# EAGLE board M837bb (EAGLE 6.6.0), part 1 of 2
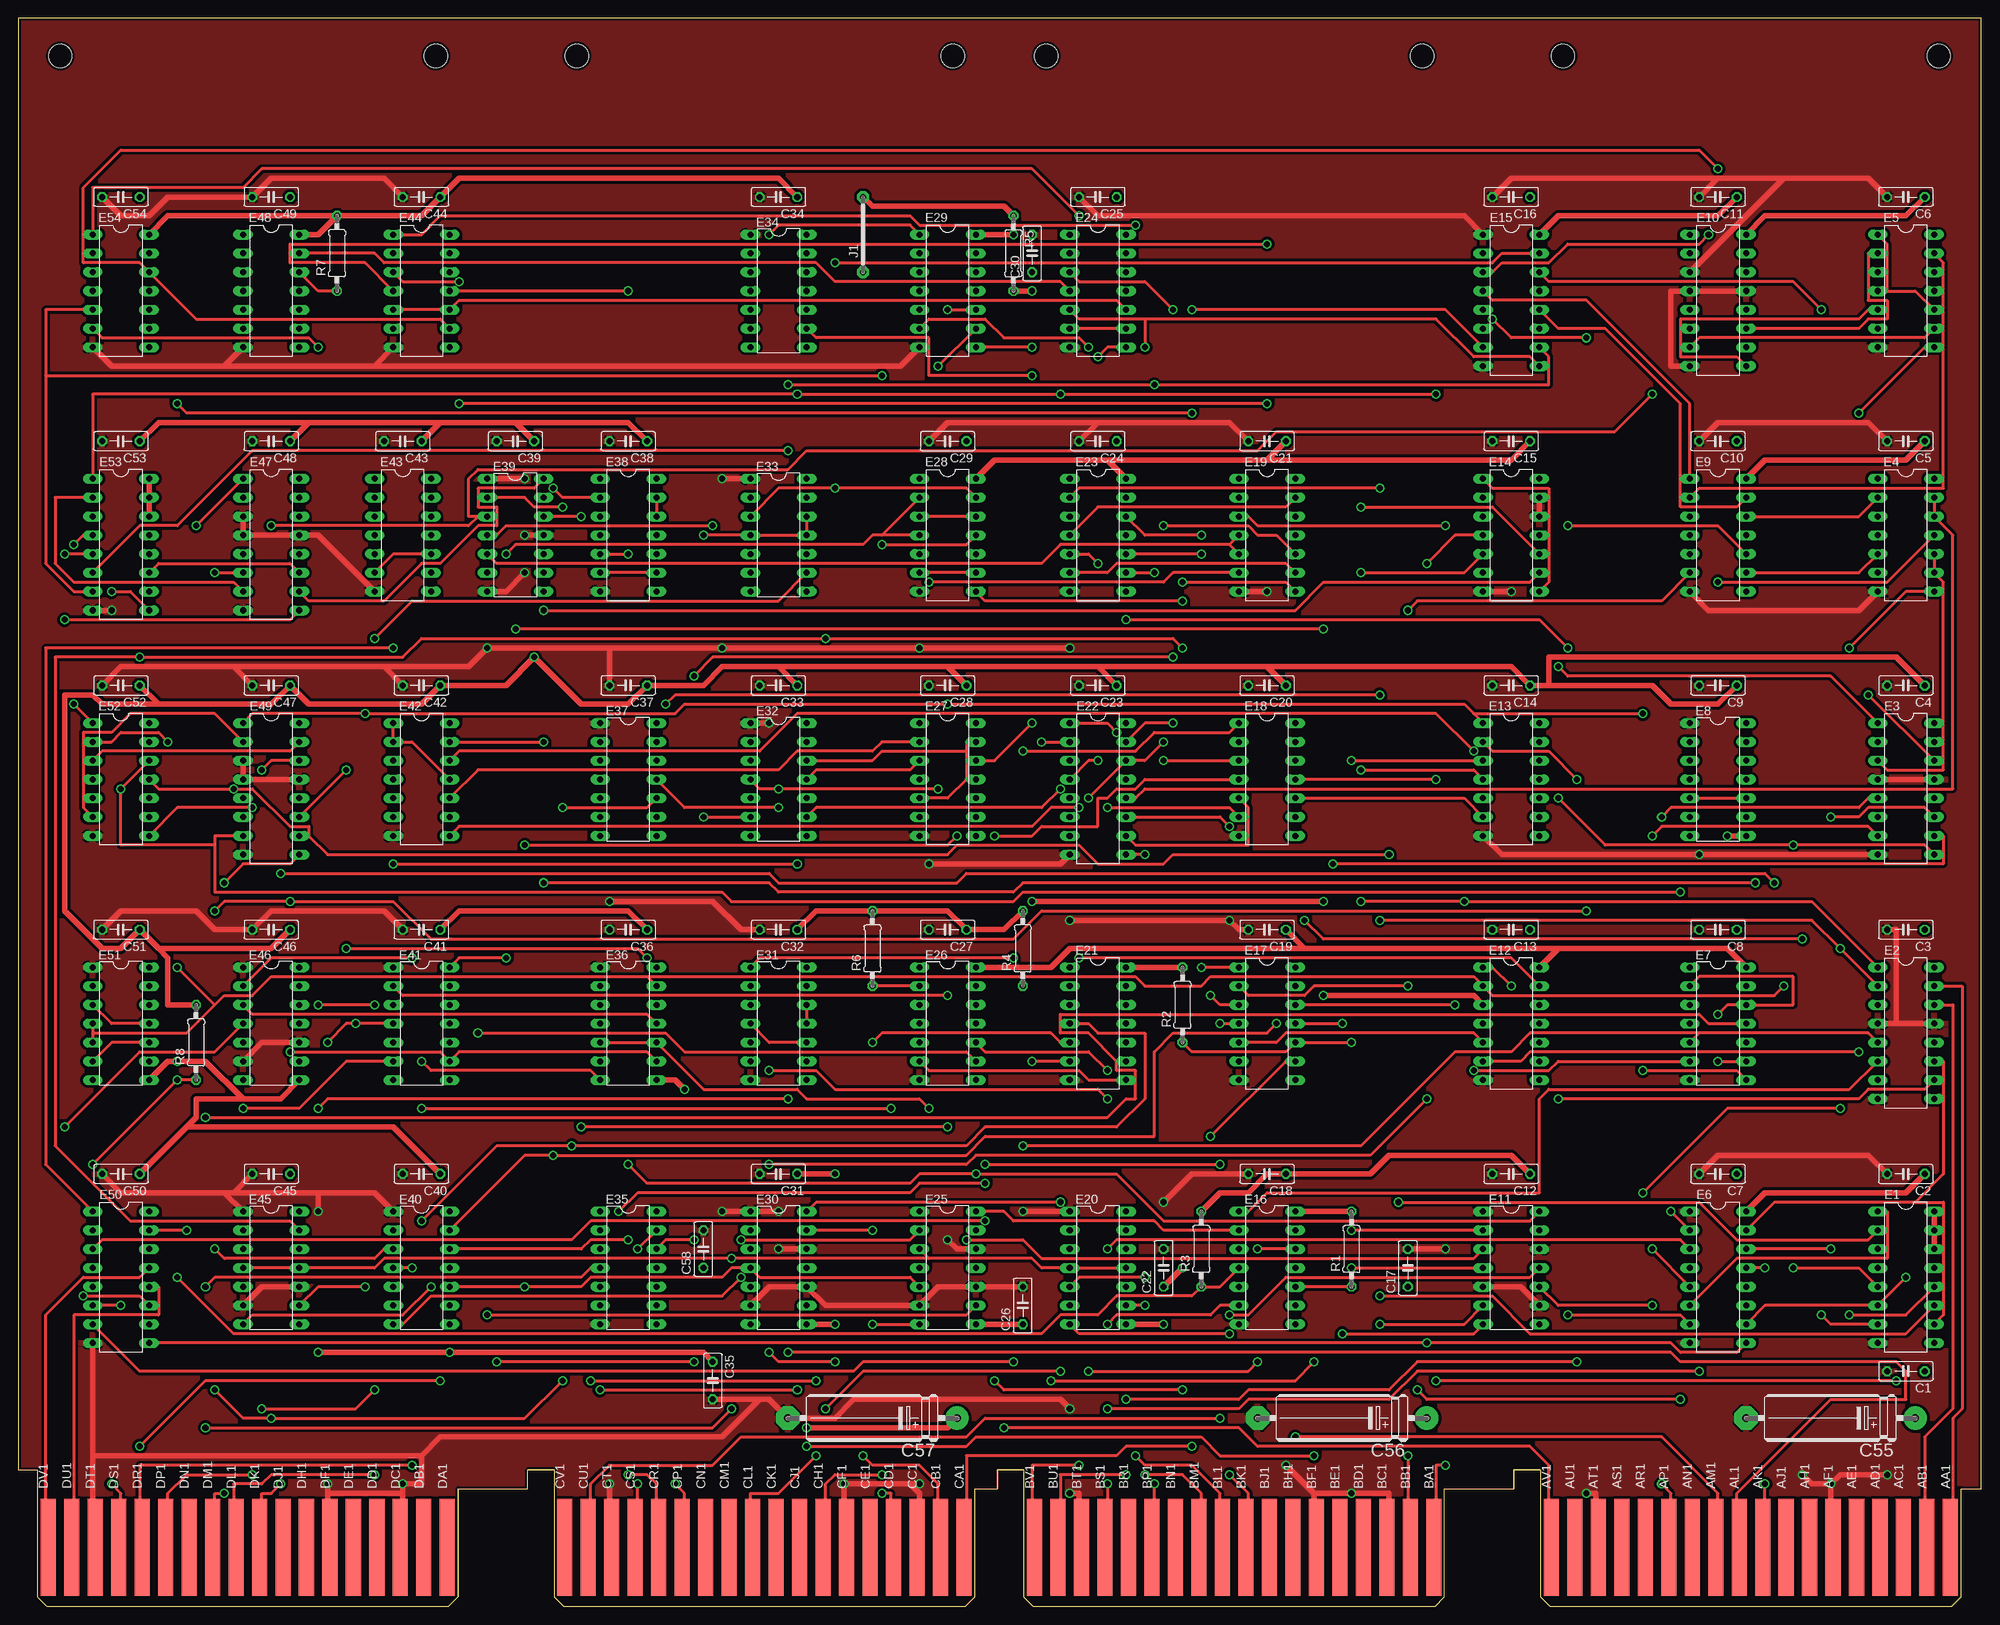
[diagram p7: board, top side]
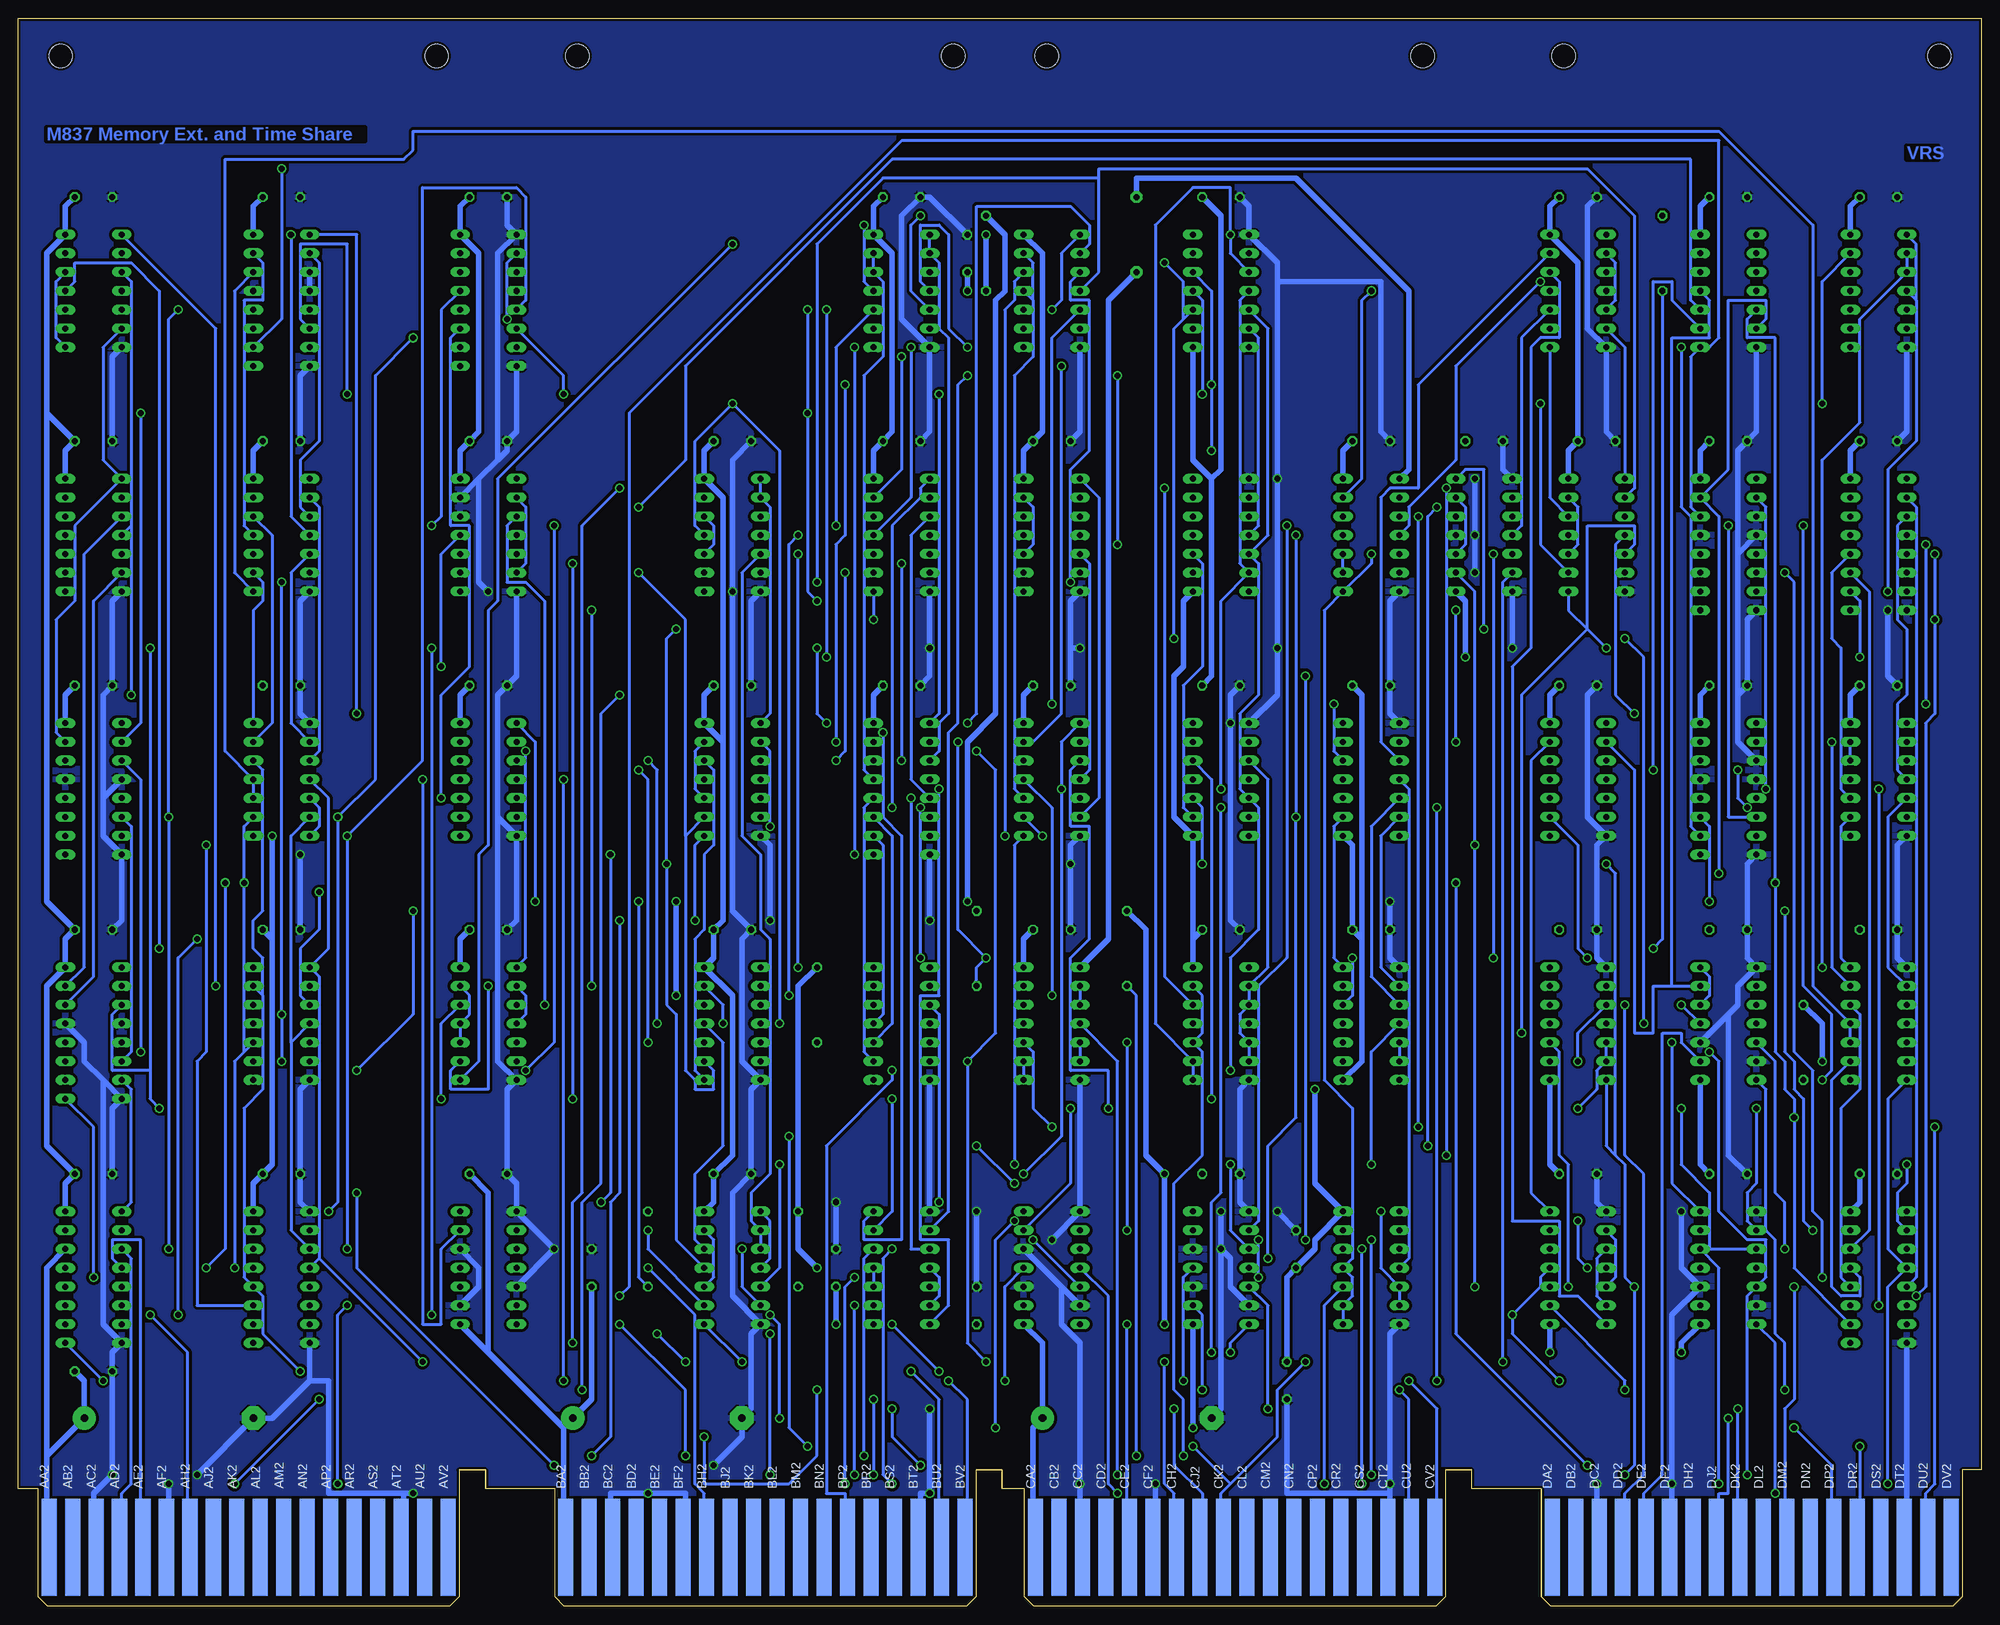
[diagram p8: board, bottom side, seen from below]

Size 265.3 x 214.63 mm. Coordinates in mm from the lower left corner, seen from the top.
Copper layers (1+16): Top 0.035mm / dielectric 1.5mm / Bottom 0.035mm
Design rules "16mils": minimum track width 16mil, minimum drill 32mil, track to track 15mil, track to pad 10mil, pad to pad 10mil, via to via 10mil, smd to smd 10mil, copper to edge 13mil, drill to drill 10mil, minimum pad ring 10mil, minimum via ring 8mil, stop-mask expansion 0mil, vias tented up to drill 0mil, thermal gap 10mil
Net classes: 1 Supply: width 0.762 mm

## Footprints (pad centres in the part's own frame; a part is rotated, then mirrored left to right if it is on the bottom)
C050-025X075 = drill 0.813 octagon: 1 -2.54,0; 2 2.54,0
E22-6 = drill 1.016 pad 3.15: + -11.43,0 | drill 1.016 pad 3.15 octagon: - 11.43,0
DIL16 = drill 0.813 long: 1 -8.89,-3.81; 2 -6.35,-3.81; 3 -3.81,-3.81; 4 -1.27,-3.81; 5 1.27,-3.81; 6 3.81,-3.81; 7 6.35,-3.81; 8 8.89,-3.81; 9 8.89,3.81; 10 6.35,3.81; 11 3.81,3.81; 12 1.27,3.81; 13 -1.27,3.81; 14 -3.81,3.81; 15 -6.35,3.81; 16 -8.89,3.81
DIL14 = drill 0.813 long: 1 -7.62,-3.81; 2 -5.08,-3.81; 3 -2.54,-3.81; 4 0,-3.81; 5 2.54,-3.81; 6 5.08,-3.81; 7 7.62,-3.81; 8 7.62,3.81; 9 5.08,3.81; 10 2.54,3.81; 11 0,3.81; 12 -2.54,3.81; 13 -5.08,3.81; 14 -7.62,3.81
EDGE-CON8 = smd 2.032 x 13.106: AA1 261.303,7.938; AB1 258.127,7.938; AC1 254.952,7.938; AD1 251.778,7.938; AE1 248.602,7.938; AF1 245.428,7.938; AH1 242.252,7.938; AJ1 239.077,7.938; AK1 235.903,7.938; AL1 232.727,7.938; AM1 229.553,7.938; AN1 226.377,7.938; AP1 223.202,7.938; AR1 220.028,7.938; AS1 216.852,7.938; AT1 213.678,7.938; AU1 210.502,7.938; AV1 207.327,7.938; BA1 191.452,7.938; BB1 188.278,7.938; BC1 185.102,7.938; BD1 181.928,7.938; BE1 178.752,7.938; BF1 175.577,7.938; BH1 172.403,7.938; BJ1 169.227,7.938; BK1 166.053,7.938; BL1 162.877,7.938; BM1 159.702,7.938; BN1 156.528,7.938; BP1 153.352,7.938; BR1 150.178,7.938; BS1 147.002,7.938; BT1 143.827,7.938; BU1 140.653,7.938; BV1 137.477,7.938; CA1 127.953,7.938; CB1 124.778,7.938; CC1 121.603,7.938; CD1 118.427,7.938; CE1 115.252,7.938; CF1 112.078,7.938; CH1 108.903,7.938; CJ1 105.728,7.938; CK1 102.552,7.938; CL1 99.377,7.938; CM1 96.203,7.938; CN1 93.028,7.938; CP1 89.853,7.938; CR1 86.677,7.938; CS1 83.502,7.938; CT1 80.328,7.938; CU1 77.153,7.938; CV1 73.978,7.938; DA1 58.102,7.938; DB1 54.928,7.938; DC1 51.752,7.938; DD1 48.578,7.938; DE1 45.403,7.938; DF1 42.227,7.938; DH1 39.053,7.938; DJ1 35.877,7.938; DK1 32.703,7.938; DL1 29.527,7.938; DM1 26.352,7.938; DN1 23.177,7.938; DP1 20.003,7.938; DR1 16.828,7.938; DS1 13.652,7.938; DT1 10.477,7.938; DU1 7.303,7.938; DV1 4.128,7.938 | smd 2.032 x 13.106 bottom: AA2 261.303,7.938; AB2 258.127,7.938; AC2 254.952,7.938; AD2 251.778,7.938; AE2 248.602,7.938; AF2 245.428,7.938; AH2 242.252,7.938; AJ2 239.077,7.938; AK2 235.903,7.938; AL2 232.727,7.938; AM2 229.553,7.938; AN2 226.377,7.938; AP2 223.202,7.938; AR2 220.028,7.938; AS2 216.852,7.938; AT2 213.678,7.938; AU2 210.502,7.938; AV2 207.327,7.938; BA2 191.452,7.938; BB2 188.278,7.938; BC2 185.102,7.938; BD2 181.928,7.938; BE2 178.752,7.938; BF2 175.577,7.938; BH2 172.403,7.938; BJ2 169.227,7.938; BK2 166.053,7.938; BL2 162.877,7.938; BM2 159.702,7.938; BN2 156.528,7.938; BP2 153.352,7.938; BR2 150.178,7.938; BS2 147.002,7.938; BT2 143.827,7.938; BU2 140.653,7.938; BV2 137.477,7.938; CA2 127.953,7.938; CB2 124.778,7.938; CC2 121.603,7.938; CD2 118.427,7.938; CE2 115.252,7.938; CF2 112.078,7.938; CH2 108.903,7.938; CJ2 105.728,7.938; CK2 102.552,7.938; CL2 99.377,7.938; CM2 96.203,7.938; CN2 93.028,7.938; CP2 89.853,7.938; CR2 86.677,7.938; CS2 83.502,7.938; CT2 80.328,7.938; CU2 77.153,7.938; CV2 73.978,7.938; DA2 58.102,7.938; DB2 54.928,7.938; DC2 51.752,7.938; DD2 48.578,7.938; DE2 45.403,7.938; DF2 42.227,7.938; DH2 39.053,7.938; DJ2 35.877,7.938; DK2 32.703,7.938; DL2 29.527,7.938; DM2 26.352,7.938; DN2 23.177,7.938; DP2 20.003,7.938; DR2 16.828,7.938; DS2 13.652,7.938; DT2 10.477,7.938; DU2 7.303,7.938; DV2 4.128,7.938
10 = drill 0.813 pad 1.6 octagon: 1 -5.08,0; 2 5.08,0
0207/10 = drill 0.813 octagon: 1 -5.08,0; 2 5.08,0
OMNIBUS = hole 3.175: 208.915,209.55; 259.715,209.55; 189.865,209.55; 139.065,209.55; 75.616,209.55; 126.416,209.55; 56.566,209.55; 5.766,209.55

## Placement (x,y rotation side)
C1  .01uf  [C050-025X075]  255.14,31.75 180 top
C2  .01uf  [C050-025X075]  255.14,58.42 180 top
C3  .01uf  [C050-025X075]  255.14,91.44 180 top
C4  .01uf  [C050-025X075]  255.14,124.46 180 top
C5  .01uf  [C050-025X075]  255.14,157.48 180 top
C6  .01uf  [C050-025X075]  255.14,190.5 180 top
C7  .01uf  [C050-025X075]  229.74,58.42 180 top
C8  .01uf  [C050-025X075]  229.74,91.44 180 top
C9  .01uf  [C050-025X075]  229.74,124.46 180 top
C10  .01uf  [C050-025X075]  229.74,157.48 180 top
C11  .01uf  [C050-025X075]  229.74,190.5 180 top
C12  .01uf  [C050-025X075]  201.8,58.42 180 top
C13  .01uf  [C050-025X075]  201.8,91.44 180 top
C14  .01uf  [C050-025X075]  201.8,124.46 180 top
C15  .01uf  [C050-025X075]  201.8,157.48 180 top
C16  .01uf  [C050-025X075]  201.8,190.5 180 top
C17  .01uf  [C050-025X075]  187.83,45.72 90 top
C18  .01uf  [C050-025X075]  168.78,58.42 180 top
C19  .01uf  [C050-025X075]  168.78,91.44 180 top
C20  .01uf  [C050-025X075]  168.78,124.46 180 top
C21  .01uf  [C050-025X075]  168.78,157.48 180 top
C22  .01uf  [C050-025X075]  154.81,45.72 90 top
C23  .01uf  [C050-025X075]  145.92,124.46 180 top
C24  .01uf  [C050-025X075]  145.92,157.48 180 top
C25  .01uf  [C050-025X075]  145.92,190.5 180 top
C26  .01uf  [C050-025X075]  135.76,40.64 90 top
C27  .01uf  [C050-025X075]  125.6,91.44 180 top
C28  .01uf  [C050-025X075]  125.6,124.46 180 top
C29  .01uf  [C050-025X075]  125.6,157.48 180 top
C30  .01uf  [C050-025X075]  137.03,182.88 90 top
C31  .01uf  [C050-025X075]  102.74,58.42 180 top
C32  .01uf  [C050-025X075]  102.74,91.44 180 top
C33  .01uf  [C050-025X075]  102.74,124.46 180 top
C34  .01uf  [C050-025X075]  102.74,190.5 180 top
C35  .01uf  [C050-025X075]  93.85,30.48 270 top
C36  .01uf  [C050-025X075]  82.42,91.44 180 top
C37  .01uf  [C050-025X075]  82.42,124.46 180 top
C38  .01uf  [C050-025X075]  82.42,157.48 180 top
C39  .01uf  [C050-025X075]  67.18,157.48 180 top
C40  .01uf  [C050-025X075]  54.48,58.42 180 top
C41  .01uf  [C050-025X075]  54.48,91.44 180 top
C42  .01uf  [C050-025X075]  54.48,124.46 180 top
C43  .01uf  [C050-025X075]  51.94,157.48 180 top
C44  .01uf  [C050-025X075]  54.48,190.5 180 top
C45  .01uf  [C050-025X075]  34.16,58.42 180 top
C46  .01uf  [C050-025X075]  34.16,91.44 180 top
C47  .01uf  [C050-025X075]  34.16,124.46 180 top
C48  .01uf  [C050-025X075]  34.16,157.48 180 top
C49  .01uf  [C050-025X075]  34.16,190.5 180 top
C50  .01uf  [C050-025X075]  13.84,58.42 180 top
C51  .01uf  [C050-025X075]  13.84,91.44 180 top
C52  .01uf  [C050-025X075]  13.84,124.46 180 top
C53  .01uf  [C050-025X075]  13.84,157.48 180 top
C54  .01uf  [C050-025X075]  13.84,190.5 180 top
C55  6.8uf  [E22-6]  244.98,25.4 180 top
C56  6.8uf  [E22-6]  178.94,25.4 180 top
C57  6.8uf  [E22-6]  115.44,25.4 180 top
C58  .01uf  [C050-025X075]  92.58,48.26 90 top
E1  DEC8235  [DIL16]  255.14,44.45 270 top
E2  DEC8271  [DIL16]  255.14,77.47 270 top
E3  DEC8271  [DIL16]  255.14,110.49 270 top
E4  7400N  [DIL14]  255.14,144.78 270 top
E5  7400N  [DIL14]  255.14,177.8 270 top
E6  DEC8235  [DIL16]  229.74,44.45 270 top
E7  N8881N  [DIL14]  229.74,78.74 270 top
E8  SP384N  [DIL14]  229.74,111.76 270 top
E9  7400N  [DIL14]  229.74,144.78 270 top
E10  DEC8271  [DIL16]  229.74,176.53 270 top
E11  SP380N  [DIL14]  201.8,45.72 270 top
E12  7410N  [DIL14]  201.8,78.74 270 top
E13  74S74N  [DIL14]  201.8,111.76 270 top
E14  7400N  [DIL14]  201.8,144.78 270 top
E15  8266  [DIL16]  201.8,176.53 270 top
E16  N8881N  [DIL14]  168.78,45.72 270 top
E17  74S74N  [DIL14]  168.78,78.74 270 top
E18  74H00N  [DIL14]  168.78,111.76 270 top
E19  7400N  [DIL14]  168.78,144.78 270 top
E20  SP380N  [DIL14]  145.92,45.72 270 top
E21  7410N  [DIL14]  145.92,78.74 270 top
E22  DEC8251  [DIL16]  145.92,110.49 270 top
E23  7404N  [DIL14]  145.92,144.78 270 top
E24  7400N  [DIL14]  145.92,177.8 270 top
E25  SP384N  [DIL14]  125.6,45.72 270 top
E26  N8881N  [DIL14]  125.6,78.74 270 top
E27  7404N  [DIL14]  125.6,111.76 270 top
E28  7400N  [DIL14]  125.6,144.78 270 top
E29  7410N  [DIL14]  125.6,177.8 270 top
E30  SP384N  [DIL14]  102.74,45.72 270 top
E31  N8881N  [DIL14]  102.74,78.74 270 top
E32  SP314N  [DIL14]  102.74,111.76 270 top
E33  SP314N  [DIL14]  102.74,144.78 270 top
E34  SP314N  [DIL14]  102.74,177.8 270 top
E35  N8881N  [DIL14]  82.42,45.72 270 top
E36  SP380N  [DIL14]  82.42,78.74 270 top
E37  SP314N  [DIL14]  82.42,111.76 270 top
E38  7420  [DIL14]  82.42,144.78 270 top
E39  SP380N  [DIL14]  67.18,144.78 270 top
E40  SP380N  [DIL14]  54.48,45.72 270 top
E41  SP384N  [DIL14]  54.48,78.74 270 top
E42  7410N  [DIL14]  54.48,111.76 270 top
E43  7420  [DIL14]  51.94,144.78 270 top
E44  7400N  [DIL14]  54.48,177.8 270 top
E45  SP380N  [DIL14]  34.16,45.72 270 top
E46  SP380N  [DIL14]  34.16,78.74 270 top
E47  DEC8271  [DIL16]  34.16,143.51 270 top
E48  7404N  [DIL14]  34.16,177.8 270 top
E49  DEC8271  [DIL16]  34.16,110.49 270 top
E50  DEC8235  [DIL16]  13.84,44.45 270 top
E51  SP384N  [DIL14]  13.84,78.74 270 top
E52  7400N  [DIL14]  13.84,111.76 270 top
E53  8266  [DIL16]  13.84,143.51 270 top
E54  7410N  [DIL14]  13.84,177.8 270 top
EDGE  [EDGE-CON8]  -0.13,0 0 top
J1  J10MM  [10]  114.17,185.42 90 top
R1  1K  [0207/10]  180.21,48.26 90 top
R2  1K  [0207/10]  157.35,81.28 90 top
R3  1K  [0207/10]  159.89,48.26 90 top
R4  1K  [0207/10]  135.76,88.9 90 top
R5  1K  [0207/10]  134.49,182.88 270 top
R6  1K  [0207/10]  115.44,88.9 90 top
R7  1K  [0207/10]  43.05,182.88 90 top
R8  1K  [0207/10]  24,76.2 90 top
U$1  OUTLINE-OMNIBUS  [OMNIBUS]  -0.13,0 0 top

## Tracks (layer width: path | path; a pad name or v marks a point on that pad's centre or on a via)
!!!(DF_ENAB*EMA_DISAB)  (via drill 0.81)
  Top 0.406: v191.64,111.76 E18.11 | v253.87,30.48 v191.64,30.48
  Bottom 0.406: v191.64,30.48 v191.64,111.76 | E1.9 v253.87,30.48
!!(DF_ENAB*EMA_DISAB)  (via drill 0.81)
  Top 0.406: v173.86,92.71 176.4,90.17 v241.17,90.17 | v243.71,39.37 244.98,38.1 E1.7
  Bottom 0.406: E18.8 173.86,102.87 v173.86,92.71 | v241.17,90.17 243.71,87.63 v243.71,39.37
!(GTF+RIB)  (via drill 0.81)
  Top 0.406: E50.9 v190.37,35.56 223.39,35.56 224.66,34.29 232.28,34.29 E6.9 | E23.2 143.38,151.13 v184.02,151.13
  Bottom 0.406: v184.02,151.13 189.1,146.05 189.1,55.88 190.37,54.61 v190.37,35.56
!(IND+RIF)  (via drill 0.81)
  Top 0.406: E6.7 224.66,39.37 v209.42,39.37 | v209.42,129.54 205.61,133.35 v149.73,133.35
  Bottom 0.406: v209.42,129.54 v209.42,39.37 | E23.8 v149.73,133.35
!(LA+TP3)  (via drill 0.81)
  Top 0.406: v34.16,146.05 60.83,146.05 62.1,147.32 | E39.3 62.1,147.32 | v220.85,163.83 215.77,158.75 170.05,158.75 167.51,156.21 106.55,156.21 104.01,153.67 62.1,153.67 60.83,152.4 60.83,147.32 62.1,147.32
  Bottom 0.406: E49.6 34.16,106.68 v34.16,146.05 | E10.6 227.2,173.99 227.2,184.15 220.85,184.15 v220.85,163.83
!(LA+TP4*LD_CTL)  (via drill 0.81)
  Top 0.406: v26.54,139.7 E47.6 | v21.46,44.45 29.08,36.83 138.3,36.83 140.84,39.37 145.92,39.37 148.46,41.91 158.62,41.91 R3.1 162.43,43.18 E16.4 | E2.6 247.52,69.85 206.88,69.85 205.61,68.58 205.61,55.88 168.78,55.88 166.24,53.34 E16.1
  Bottom 0.406: E2.6 250.06,74.93 250.06,105.41 E3.6 | v26.54,139.7 25.27,138.43 25.27,74.93 22.73,72.39 22.73,53.34 21.46,52.07 v21.46,44.45 | E16.1 163.7,52.07 163.7,46.99 E16.4
![D_IN+D(JMP+JMS)+(F*MD3)(JMP+JMS)]  (via drill 0.81)
  Top 0.406: v208.15,68.58 248.79,68.58 250.06,69.85 257.68,69.85 E2.10
  Bottom 0.406: E12.12 208.15,78.74 v208.15,68.58
!BUF_D_IN
  Top 0.406: E51.6 12.57,76.2 E51.10 | E51.3 12.57,78.74 E51.11 | E8.5 E8.10
  Bottom 0.406: E51.10 E51.11 22.73,83.82 22.73,186.69 35.43,199.39 211.96,199.39 211.96,196.85 213.23,195.58 237.36,195.58 237.36,115.57 E8.11 E8.10 | E8.7 224.66,105.41 224.66,107.95 E8.5
!CDF  (via drill 0.81)
  Top 0.406: E53.7 7.49,137.16 3.68,140.97 3.68,166.37 | 3.68,166.37 3.68,175.26 E54.5 | E28.11 128.14,143.51 v116.71,143.51 | 3.68,166.37 v116.71,166.37
  Bottom 0.406: v116.71,166.37 v116.71,143.51
!CIF  (via drill 0.81)
  Top 0.406: E28.8 130.68,135.89 v157.35,135.89 | v158.62,175.26 192.91,175.26 E15.7 | v21.46,162.56 22.73,161.29 v158.62,161.29
  Bottom 0.406: v157.35,135.89 158.62,137.16 v158.62,161.29 v158.62,175.26 | E54.13 21.46,179.07 v21.46,162.56
!CINT
  Bottom 0.406: E22.13 151,113.03 151,166.37 148.46,168.91 148.46,179.07 E24.12 E24.13
!CPMA_DISABLE  (via drill 0.81)
  Top 0.406: E11.11 204.34,44.45 171.32,44.45 166.24,39.37 v163.7,39.37 | v162.43,25.4 130.68,25.4 128.14,22.86 97.66,22.86 93.85,19.05 79.88,19.05 77.34,16.51 77.34,8.89 EDGE.CU1
  Bottom 0.406: v163.7,39.37 162.43,38.1 v162.43,25.4
!CUF  (via drill 0.81)
  Top 0.406: E22.4 144.65,114.3 v145.92,114.3 | v145.92,140.97 144.65,142.24 E23.5
  Bottom 0.406: v145.92,140.97 v145.92,114.3
!D  (via drill 0.81)
  Top 0.406: v48.13,29.21 45.59,26.67 v32.89,26.67
  Bottom 0.406: E40.9 48.13,30.48 v48.13,29.21 | v32.89,26.67 32.89,8.89 EDGE.DK2
!D_IN  (via drill 0.81)
  Top 0.406: E5.10 256.41,177.8 252.6,177.8 | E5.4 252.6,177.8 | E5.1 252.6,184.15 252.6,177.8 | E51.4 10.03,77.47 | 10.03,77.47 E51.5 | 84.96,85.09 E36.13 | 84.96,85.09 34.16,85.09 31.62,82.55 27.81,82.55 26.54,81.28 | 26.54,81.28 22.73,77.47 10.03,77.47 | 26.54,81.28 v21.46,86.36 | 84.96,85.09 151,85.09 152.27,83.82 159.89,83.82 161.16,85.09 196.72,85.09 E12.2 199.26,82.55 237.36,82.55 v238.63,83.82
  Bottom 0.406: E12.4 196.72,80.01 196.72,82.55 E12.2 | E54.2 E54.3 16.38,173.99 16.38,160.02 21.46,154.94 v21.46,86.36 | E5.1 238.63,172.72 v238.63,83.82
!DATA03  (via drill 0.81)
  Top 0.406: E50.3 11.3,49.53 74.8,49.53 77.34,52.07 v130.68,52.07 | v133.22,24.13 164.97,24.13 167.51,21.59 204.34,21.59 206.88,19.05 206.88,8.89 EDGE.AV1
  Bottom 0.406: v130.68,52.07 133.22,49.53 v133.22,24.13
!DATA05  (via drill 0.81)
  Top 0.406: v147.19,16.51 147.19,8.89 EDGE.BS1 | v147.19,48.26 148.46,49.53 224.66,49.53 E6.3
  Bottom 0.406: E6.3 228.47,50.8 228.47,76.2 | E7.4 228.47,76.2 | E8.6 228.47,104.14 228.47,76.2 | v147.19,16.51 148.46,17.78 148.46,46.99 v147.19,48.26
!DATA06  (via drill 0.81)
  Top 0.406: v149.73,17.78 140.84,17.78 140.84,8.89 EDGE.BU1 | v149.73,27.94 164.97,27.94 166.24,29.21 185.29,29.21 189.1,33.02 v210.69,33.02
  Bottom 0.406: 224.66,46.99 E6.4 | 224.66,46.99 224.66,85.09 E7.1 223.39,88.9 223.39,109.22 E8.4 | v149.73,27.94 v149.73,17.78 | 224.66,46.99 v210.69,33.02
!DATA07  (via drill 0.81)
  Top 0.406: v143.38,19.05 137.03,19.05 137.03,8.89 EDGE.BV1 | v147.19,26.67 164.97,26.67 166.24,27.94 185.29,27.94 189.1,31.75 v227.2,31.75
  Bottom 0.406: 232.28,82.55 232.28,69.85 234.82,67.31 234.82,44.45 E6.12 232.28,41.91 232.28,36.83 v227.2,31.75 | E7.13 232.28,82.55 | E8.12 232.28,113.03 232.28,93.98 233.55,92.71 233.55,88.9 232.28,87.63 232.28,82.55 | v143.38,19.05 147.19,22.86 v147.19,26.67
!DATA08  (via drill 0.81)
  Top 0.406: v236.09,45.72 E6.13 | v53.21,19.05 16.38,19.05 16.38,8.89 EDGE.DR1 | v70.99,97.79 101.47,97.79 102.74,96.52 134.49,96.52 135.76,97.79 v234.82,97.79
  Bottom 0.406: v236.09,45.72 236.09,73.66 234.82,74.93 | E7.10 234.82,74.93 | E8.9 234.82,105.41 v234.82,97.79 234.82,74.93 | v53.21,19.05 70.99,36.83 v70.99,97.79
!DATA09  (via drill 0.81)
  Top 0.406: v12.57,16.51 13.84,15.24 13.84,8.89 EDGE.DS1
  Bottom 0.406: E51.7 12.57,68.58 12.57,48.26 E50.4 12.57,43.18 v12.57,16.51
!DATA10
  Top 0.406: E50.12 18.92,43.18 18.92,39.37 7.49,39.37 7.49,8.89 EDGE.DU1
  Bottom 0.406: E50.12 18.92,44.45 18.92,67.31 16.38,69.85 16.38,80.01 E51.12
!DATA11
  Top 0.406: E50.13 16.38,44.45 8.76,44.45 3.68,39.37 3.68,8.89 EDGE.DV1
  Bottom 0.406: E51.9 20.19,71.12 20.19,43.18 18.92,41.91 16.38,41.91 16.38,44.45 E50.13
!DF_ENABLE
  Bottom 0.406: E17.8 173.86,72.39 173.86,90.17 172.59,91.44 172.59,101.6 171.32,102.87 171.32,113.03 E18.12
!EMA0
  Bottom 0.406: E1.3 250.06,46.99 250.06,16.51 251.33,15.24 251.33,8.89 EDGE.AD2
!EMA1
  Bottom 0.406: E1.4 252.6,46.99 252.6,49.53 248.79,49.53 248.79,8.89 EDGE.AE2
!EMA2  (via drill 0.81)
  Top 0.406: E1.12 255.14,39.37 v247.52,39.37
  Bottom 0.406: v247.52,39.37 242.44,34.29 242.44,8.89 EDGE.AH2
!EMA_DISABLE
  Top 0.406: E13.6 195.45,109.22 E18.10
  Bottom 0.406: E18.10 173.86,110.49 173.86,115.57 E18.13
!EXT_LD  (via drill 0.81)
  Top 0.406: v26.54,48.26 27.81,46.99 48.13,46.99 49.4,48.26 E40.3
  Bottom 0.406: E40.6 51.94,41.91 51.94,46.99 E40.3 | E46.5 27.81,73.66 27.81,55.88 26.54,54.61 v26.54,48.26
!F  (via drill 0.81)
  Top 0.406: v26.54,29.21 30.35,25.4 v34.16,25.4 68.45,25.4 v73.53,30.48 | E37.10 84.96,107.95 v73.53,107.95
  Bottom 0.406: E46.7 29.08,69.85 29.08,50.8 27.81,49.53 27.81,36.83 26.54,35.56 v26.54,29.21 | v34.16,25.4 34.16,15.24 35.43,15.24 35.43,8.89 EDGE.DJ2 | v73.53,30.48 v73.53,107.95
!F_SET  (via drill 0.81)
  Top 0.406: v96.39,26.67 93.85,24.13 v25.27,24.13
  Bottom 0.406: E30.5 96.39,40.64 v96.39,26.67 | v25.27,24.13 20.19,19.05 20.19,8.89 EDGE.DP2
!GTF  (via drill 0.81)
  Top 0.406: E18.4 152.27,111.76 151,110.49 148.46,110.49 147.19,109.22 145.92,109.22 145.92,105.41 138.3,105.41 137.03,104.14 v131.95,104.14
  Bottom 0.406: v131.95,104.14 131.95,175.26 130.68,176.53 130.68,179.07 E29.12
!IBIFDF_CLR  (via drill 0.81)
  Top 0.406: R1.1 E16.10 | E49.1 31.62,120.65 v46.86,120.65 88.77,120.65 90.04,121.92 v125.6,121.92 195.45,121.92 196.72,120.65 | 196.72,120.65 E13.1 | 196.72,120.65 v219.58,120.65 | E2.1 242.44,95.25 v195.45,95.25 v181.48,95.25
  Bottom 0.406: E16.13 171.32,49.53 171.32,44.45 E16.10 | v46.86,120.65 49.4,123.19 49.4,143.51 E43.4 | E29.5 125.6,171.45 v125.6,121.92 | E10.1 219.58,185.42 v219.58,120.65 | v195.45,95.25 195.45,116.84 E13.1 | R1.1 181.48,44.45 v181.48,95.25
!IND  (via drill 0.81)
  Top 0.406: E50.7 16.38,31.75 112.9,31.75 114.17,33.02 v134.49,33.02 | E21.6 v137.03,73.66 | E18.1 163.7,118.11 153.54,118.11 151,115.57 v135.76,115.57
  Bottom 0.406: E18.1 163.7,120.65 163.7,148.59 E19.2 E19.1 | v134.49,33.02 137.03,35.56 v137.03,73.66 133.22,77.47 133.22,113.03 v135.76,115.57
!IND1  (via drill 0.81)
  Top 0.406: v78.61,29.21 v105.28,29.21
  Bottom 0.406: E30.9 105.28,39.37 v105.28,29.21 | v78.61,29.21 77.34,27.94 77.34,8.89 EDGE.CU2
!IND2  (via drill 0.81)
  Top 0.406: v77.34,30.48 v107.82,30.48
  Bottom 0.406: E30.11 107.82,44.45 v107.82,30.48 | v77.34,30.48 73.53,26.67 73.53,8.89 EDGE.CV2
!INITIALIZE  (via drill 0.81)
  Top 0.406: E40.13 68.45,60.96 v72.26,60.96 128.14,60.96 130.68,63.5 153.54,63.5 153.54,74.93 156.08,77.47 168.78,77.47 v170.05,78.74 | v72.26,151.13 73.53,149.86 E38.2
  Bottom 0.406: v72.26,151.13 v72.26,60.96 | E17.13 170.05,81.28 v170.05,78.74
!INT_IN_PROGRESS  (via drill 0.81)
  Top 0.406: v76.07,147.32 E39.12 | v125.6,64.77 v76.07,64.77 | v147.19,72.39 144.65,74.93 130.68,74.93 E26.10
  Bottom 0.406: v76.07,64.77 v76.07,147.32 | v125.6,64.77 128.14,67.31 128.14,74.93 E26.10 | v147.19,72.39 147.19,71.12 156.08,62.23 156.08,15.24 153.54,15.24 153.54,8.89 EDGE.BP2
!INT_RQST  (via drill 0.81)
  Top 0.406: v88.77,16.51 90.04,15.24 90.04,8.89 EDGE.CP1
  Bottom 0.406: E35.10 88.77,40.64 v88.77,16.51
!INTERNAL_IO  (via drill 0.81)
  Top 0.406: E31.4 101.47,76.2 E31.10 | v107.82,20.32 102.74,15.24 98.93,15.24 98.93,8.89 EDGE.CL1
  Bottom 0.406: E31.13 105.28,82.55 105.28,77.47 E31.10 105.28,74.93 105.28,60.96 109.09,57.15 109.09,29.21 107.82,27.94 v107.82,20.32
!IO_PAUSE  (via drill 0.81)
  Top 0.406: v116.71,15.24 117.98,15.24 117.98,8.89 EDGE.CD1
  Bottom 0.406: E25.4 117.98,41.91 117.98,16.51 v116.71,15.24
!IR00  (via drill 0.81)
  Top 0.406: v48.13,81.28 v40.51,81.28
  Bottom 0.406: v40.51,81.28 E46.11 | v48.13,81.28 48.13,60.96 45.59,58.42 45.59,17.78 48.13,15.24 48.13,8.89 EDGE.DD2
!IR01
  Bottom 0.406: E46.9 40.51,76.2 40.51,77.47 43.05,77.47 43.05,17.78 45.59,15.24 45.59,8.89 EDGE.DE2
!KEY_CTL  (via drill 0.81)
  Top 0.406: E46.4 26.54,74.93 16.38,74.93 v6.22,64.77
  Bottom 0.406: v6.22,64.77 6.22,16.51 7.49,15.24 7.49,8.89 EDGE.DU2
!LOAD_CNTL  (via drill 0.81)
  Top 0.406: E40.10 v68.45,43.18 76.07,43.18 77.34,44.45 95.12,44.45 96.39,45.72 E30.4 100.2,44.45 120.52,44.45 E25.5 | E11.3 196.72,46.99 138.3,46.99 135.76,49.53 v128.14,49.53 | v126.87,104.14 125.6,102.87 v68.45,102.87
  Bottom 0.406: E25.5 v128.14,49.53 | E39.9 68.45,137.16 v68.45,102.87 v68.45,43.18 | v126.87,104.14 E27.9
!MD00  (via drill 0.81)
  Top 0.406: v87.5,121.92 88.77,123.19 v184.02,123.19 | v189.1,29.21 190.37,27.94 v224.66,27.94 | v236.09,16.51 236.09,8.89 EDGE.AK1
  Bottom 0.406: E37.12 87.5,115.57 v87.5,121.92 | v184.02,123.19 186.56,120.65 186.56,57.15 189.1,54.61 v189.1,29.21 | v236.09,16.51 v224.66,27.94
!MD01  (via drill 0.81)
  Top 0.406: E37.11 90.04,107.95 v102.74,107.95 | v104.01,34.29 223.39,34.29 224.66,33.02 253.87,33.02 255.14,31.75 255.14,27.94 244.98,27.94 232.28,15.24 232.28,8.89 EDGE.AL1
  Bottom 0.406: v102.74,107.95 102.74,55.88 104.01,54.61 v104.01,34.29
!MD02  (via drill 0.81)
  Top 0.406: v131.95,30.48 133.22,29.21 v157.35,29.21 | v172.59,22.86 222.12,22.86 229.74,15.24 229.74,8.89 EDGE.AM1
  Bottom 0.406: E25.11 131.95,43.18 v131.95,30.48 | v157.35,29.21 157.35,20.32 161.16,16.51 172.59,16.51 v172.59,22.86
!MD03  (via drill 0.81)
  Top 0.406: E11.10 208.15,40.64 v220.85,40.64 | v222.12,16.51 223.39,15.24 223.39,8.89 EDGE.AP1
  Bottom 0.406: v220.85,40.64 222.12,39.37 v222.12,16.51
!MD04  (via drill 0.81)
  Top 0.406: E20.7 143.38,36.83 v163.7,36.83 | v163.7,17.78 166.24,15.24 166.24,8.89 EDGE.BK1 | E32.9 107.82,107.95 138.3,107.95 v140.84,110.49
  Bottom 0.406: E32.9 107.82,107.95 107.82,124.46 105.28,127 105.28,140.97 E33.10 | v163.7,17.78 v163.7,36.83 | v140.84,110.49 140.84,82.55 143.38,82.55 143.38,49.53 139.57,49.53 139.57,40.64 E20.7
!MD05  (via drill 0.81)
  Top 0.406: v151,20.32 152.27,19.05 158.62,19.05 162.43,15.24 162.43,8.89 EDGE.BL1
  Bottom 0.406: E20.12 151,46.99 v151,20.32
!MD06  (via drill 0.81)
  Top 0.406: v152.27,40.64 E20.9 | v152.27,17.78 157.35,17.78 159.89,15.24 159.89,8.89 EDGE.BM1
  Bottom 0.406: v152.27,17.78 v152.27,40.64
!MD07  (via drill 0.81)
  Top 0.406: E20.5 143.38,44.45 v152.27,44.45 | v153.54,16.51 153.54,8.89 EDGE.BP1
  Bottom 0.406: v152.27,44.45 153.54,43.18 v153.54,16.51
!MD08  (via drill 0.81)
  Top 0.406: v35.43,16.51 34.16,15.24 32.89,15.24 32.89,8.89 EDGE.DK1
  Bottom 0.406: E45.12 35.43,45.72 v35.43,16.51
!MD09  (via drill 0.81)
  Top 0.406: E45.9 40.51,43.18 v46.86,43.18 | v50.67,100.33 v105.28,100.33 | v48.13,17.78 34.16,17.78 32.89,16.51 29.08,16.51 29.08,8.89 EDGE.DL1
  Bottom 0.406: 49.4,60.96 50.67,62.23 E41.7 | 49.4,60.96 48.13,59.69 48.13,44.45 v46.86,43.18 46.86,19.05 v48.13,17.78 | E32.10 105.28,107.95 v105.28,100.33 | v50.67,100.33 49.4,99.06 49.4,60.96
!MD10  (via drill 0.81)
  Top 0.406: v27.81,15.24 26.54,15.24 26.54,8.89 EDGE.DM1 | v55.75,43.18 51.94,39.37 31.62,39.37 E45.7
  Bottom 0.406: E45.7 27.81,35.56 v27.81,15.24 | E41.10 57.02,74.93 57.02,60.96 55.75,59.69 v55.75,43.18
!MD11  (via drill 0.81)
  Top 0.406: E36.9 84.96,74.93 59.56,74.93 E41.9 57.02,74.93 v36.7,74.93 | v31.62,17.78 22.73,17.78 20.19,15.24 20.19,8.89 EDGE.DP1
  Bottom 0.406: v31.62,17.78 31.62,41.91 E45.5 29.08,44.45 29.08,49.53 31.62,49.53 35.43,53.34 35.43,73.66 v36.7,74.93
!POWER_OK  (via drill 0.81)
  Top 0.406: E11.2 v180.21,50.8
  Bottom 0.406: E16.9 180.21,48.26 v180.21,50.8
!RDF
  Top 0.406: E4.13 E4.12 261.49,144.78 261.49,110.49 152.27,110.49 151,109.22 E22.12
  Bottom 0.406: E21.9 151,74.93 151,107.95 E22.12
!RIB
  Top 0.406: E18.5 166.24,107.95 166.24,102.87 151,102.87 E22.10
  Bottom 0.406: E21.11 148.46,80.01 148.46,102.87 E22.10
!RIF  (via drill 0.81)
  Top 0.406: v163.7,105.41 162.43,106.68 E22.11
  Bottom 0.406: E21.10 147.19,78.74 147.19,104.14 E22.11 | E18.2 163.7,115.57 v163.7,105.41
!RMF  (via drill 0.81)
  Top 0.406: E53.9 15.11,137.16 v12.57,137.16 | E24.5 143.38,173.99 152.27,173.99 | 152.27,173.99 191.64,173.99 196.72,168.91 204.34,168.91 E15.9 | v152.27,101.6 E22.9 | 152.27,173.99 v152.27,170.18 | E54.1 10.03,191.77 30.35,191.77 32.89,194.31 137.03,194.31 v143.38,187.96
  Bottom 0.406: v12.57,137.16 12.57,153.67 8.76,157.48 8.76,176.53 | E54.4 8.76,176.53 | E54.1 8.76,184.15 8.76,176.53 | v152.27,170.18 v152.27,101.6 | v143.38,187.96 144.65,186.69 144.65,177.8 E24.5
!RTF  (via drill 0.81)
  Top 0.406: v137.03,170.18 E29.8 | E48.13 48.13,182.88 49.4,181.61 107.82,181.61 110.36,179.07 140.84,179.07 E24.4
  Bottom 0.406: v137.03,170.18 139.57,172.72 139.57,185.42 140.84,186.69 143.38,186.69 143.38,179.07 E24.4
!RUN  (via drill 0.81)
  Top 0.406: v167.51,33.02 166.24,31.75 v144.65,31.75
  Bottom 0.406: v167.51,33.02 E16.8 | v144.65,31.75 140.84,27.94 140.84,8.89 EDGE.BU2
!SINT
  Bottom 0.406: E22.3 140.84,115.57 140.84,119.38 139.57,120.65 139.57,171.45 140.84,172.72 140.84,181.61 E24.2 E24.1
!SKIP  (via drill 0.81)
  Top 0.406: v83.69,48.26 E35.13 | v83.69,16.51 83.69,8.89 EDGE.CS1
  Bottom 0.406: v83.69,16.51 v83.69,48.26
!SUF
  Bottom 0.406: E22.5 144.65,111.76 144.65,144.78 E23.3
!TP_CB1
  Bottom 0.762: E26.1 117.98,90.17 117.98,176.53 J1.1
!TS1  (via drill 0.81)
  Top 0.406: v91.31,33.02 v64.64,33.02 | E11.6 195.45,38.1 v184.02,38.1 | v175.13,20.32 162.43,20.32 159.89,22.86 129.41,22.86 128.14,21.59 v106.55,21.59
  Bottom 0.406: E39.6 64.64,138.43 v64.64,33.02 | v91.31,33.02 95.12,29.21 95.12,22.86 101.47,16.51 | 101.47,16.51 102.74,15.24 102.74,8.89 EDGE.CK2 | v184.02,38.1 175.13,29.21 v175.13,20.32 | 101.47,16.51 v106.55,21.59
!TS_DISABLE  (via drill 0.81)
  Top 0.762: E12.3 196.72,82.55 v176.4,82.55 | v137.03,95.25 v176.4,95.25 | J1.2 115.44,189.23 133.22,189.23 R5.1
  Bottom 0.762: E38.1 77.34,153.67 77.34,177.8 92.58,193.04 114.17,193.04 J1.2 | v176.4,95.25 v176.4,82.55 | v137.03,95.25 137.03,116.84 133.22,120.65 133.22,176.53 131.95,177.8 131.95,185.42 R5.1
!USER_MODE  (via drill 0.81)
  Top 0.406: v25.27,43.18 26.54,44.45 76.07,44.45 77.34,45.72 E35.4
  Bottom 0.406: E35.4 77.34,46.99 77.34,110.49 E37.4 | v25.27,43.18 25.27,27.94 26.54,26.67 26.54,8.89 EDGE.DM2
(D_IN+CIF+RMF)  (via drill 0.81)
  Top 0.406: v229.74,194.31 227.2,196.85 13.84,196.85 8.76,191.77 8.76,181.61 16.38,181.61 E54.12 24,173.99 57.02,173.99 E44.9
  Bottom 0.406: E10.10 229.74,173.99 v229.74,194.31
C1L  (via drill 0.81)
  Top 0.406: v116.71,17.78 110.36,17.78 109.09,16.51 109.09,8.89 EDGE.CH1
  Bottom 0.406: E26.4 116.71,73.66 v116.71,17.78
CINT  (via drill 0.81)
  Top 0.406: v151,186.69 121.79,186.69 120.52,187.96 57.02,187.96 54.48,185.42 E44.1
  Bottom 0.406: E24.11 151,179.07 v151,186.69
CPMA_DISABLE  (via drill 0.81)
  Top 0.406: v210.69,111.76 206.88,115.57 199.26,115.57 E13.2
  Bottom 0.406: E11.13 208.15,48.26 208.15,38.1 210.69,38.1 v210.69,111.76
D  (via drill 0.81)
  Top 0.406: E14.9 204.34,138.43 176.4,138.43 172.59,134.62 v70.99,134.62 | E42.13 v70.99,116.84
  Bottom 0.406: E40.14 60.83,55.88 60.83,114.3 E42.13 | v70.99,116.84 v70.99,134.62
DB
  Top 0.406: E17.5 170.05,76.2 171.32,77.47 196.72,77.47 E12.5
DB_LOAD  (via drill 0.81)
  Top 0.406: E17.2 166.24,82.55 173.86,82.55 175.13,83.82 v187.83,83.82 | v187.83,134.62 189.1,135.89 222.12,135.89 E9.6
  Bottom 0.406: v187.83,134.62 v187.83,83.82
DF0  (via drill 0.81)
  Top 0.406: v13.84,40.64 E50.6 | E52.12 v13.84,110.49 13.84,102.87 26.54,102.87 | v224.66,96.52 135.76,96.52 134.49,95.25 96.39,95.25 95.12,96.52 26.54,96.52 26.54,102.87 | 26.54,102.87 26.54,104.14 E49.7
  Bottom 0.406: v13.84,110.49 v13.84,40.64 | E52.12 E52.13 | E7.3 227.2,82.55 227.2,88.9 224.66,91.44 v224.66,96.52
DF1  (via drill 0.81)
  Top 0.406: v27.81,97.79 30.35,100.33 36.7,100.33 E49.9 | E7.11 228.47,78.74 227.2,80.01 140.84,80.01 140.84,77.47 144.65,77.47 148.46,73.66 148.46,72.39 151,72.39 151,68.58 149.73,68.58 147.19,66.04 v25.27,66.04
  Bottom 0.406: E50.10 25.27,45.72 v25.27,66.04 25.27,68.58 26.54,69.85 26.54,73.66 27.81,74.93 v27.81,97.79 27.81,171.45 31.62,171.45 31.62,173.99 E48.5
DF2  (via drill 0.81)
  Top 0.406: v22.73,50.8 E50.15 | v26.54,93.98 27.81,95.25 v36.7,95.25 50.67,95.25 55.75,90.17 134.49,90.17 138.3,93.98 v211.96,93.98 | E7.8 232.28,72.39 v219.58,72.39 | E49.11 v44.32,113.03
  Bottom 0.406: v22.73,50.8 24,52.07 24,68.58 25.27,69.85 25.27,73.66 26.54,74.93 v26.54,93.98 | v36.7,95.25 36.7,105.41 E49.11 | v219.58,72.39 211.96,80.01 v211.96,93.98 | E48.9 41.78,176.53 41.78,179.07 44.32,179.07 v44.32,113.03
DF_ENABLE  (via drill 0.81)
  Top 0.406: E14.5 195.45,139.7 v181.48,139.7 | v158.62,21.59 149.73,21.59 148.46,20.32 128.14,20.32 128.14,8.89 EDGE.CA1 | v161.16,63.5 171.32,73.66 E17.9
  Bottom 0.406: E17.9 171.32,72.39 171.32,69.85 173.86,69.85 173.86,71.12 175.13,72.39 175.13,104.14 | E18.9 175.13,104.14 | v181.48,139.7 175.13,133.35 175.13,104.14 | v158.62,21.59 161.16,24.13 v161.16,63.5
ERROR
  Bottom 0.406: E37.3 81.15,116.84 81.15,149.86 79.88,151.13 76.07,151.13 76.07,165.1 E44.13
F  (via drill 0.81)
  Top 0.406: E46.2 34.16,87.63 v53.21,87.63
  Bottom 0.406: v53.21,87.63 54.48,88.9 54.48,102.87 E42.9
GND  (via drill 0.81)
  Top 0.762: v211.96,15.24 213.23,15.24 213.23,8.89 EDGE.AT2 | v244.98,16.51 244.98,8.89 EDGE.AF2 | v244.98,16.51 246.25,17.78 v252.6,17.78 | v192.91,48.26 C17.2 | E11.9 203.07,43.18 E11.5 | E3.13 E3.4 | E2.13 253.87,78.74 | 253.87,78.74 E2.4 | E3.8 v227.2,101.6 200.53,101.6 E13.7 | 253.87,78.74 253.87,91.44 C3.2 | C7.2 229.74,60.96 250.06,60.96 C2.2 | E9.7 228.47,134.62 248.79,134.62 E4.7 | v241.17,17.78 242.44,16.51 v244.98,16.51 | 175.13,15.24 175.13,8.89 EDGE.BF2 | 175.13,15.24 v180.21,15.24 185.29,15.24 185.29,8.89 EDGE.BC1 | E22.8 140.84,100.33 v123.06,100.33 | v154.81,54.61 158.62,58.42 C18.2 | C19.2 164.97,91.44 v163.7,92.71 v142.11,92.71 | v171.32,19.05 175.13,15.24 | E14.13 E14.12 | C10.2 229.74,160.02 250.06,160.02 C5.2 | E10.13 E10.4 223.39,177.8 223.39,167.64 E10.8 | 229.74,193.04 C11.2 | 238.63,193.04 250.06,193.04 C6.2 | 238.63,193.04 229.74,193.04 | 238.63,193.04 E10.3 | C16.2 201.8,193.04 229.74,193.04 | C21.2 163.7,160.02 145.92,160.02 | C24.2 145.92,160.02 | v168.78,137.16 E19.7 | C29.2 125.6,160.02 145.92,160.02 | E15.1 195.45,187.96 145.92,187.96 C25.2 | v201.8,137.16 E14.7 | 10.03,20.32 10.03,8.89 EDGE.DT2 | 10.03,20.32 E50.8 | 41.78,15.24 41.78,8.89 EDGE.DF2 | 51.94,15.24 41.78,15.24 | 51.94,15.24 51.94,8.89 EDGE.DC1 | 51.94,15.24 v51.94,16.51 54.48,16.51 54.48,20.32 | E45.6 32.89,43.18 E45.10 | v41.78,16.51 41.78,15.24 | 54.48,20.32 10.03,20.32 | v79.88,16.51 79.88,8.89 EDGE.CT2 | EDGE.CF2 111.63,8.89 v111.63,16.51 120.52,16.51 | 120.52,16.51 121.79,15.24 121.79,8.89 EDGE.CC1 | v142.11,15.24 143.38,15.24 143.38,8.89 EDGE.BT2 | v95.12,53.34 E30.1 v102.74,53.34 | 100.2,27.94 101.47,27.94 C57.- 110.36,25.4 112.9,27.94 140.84,27.94 v142.11,26.67
  Top 0.762: 100.2,27.94 C35.2 | E30.6 101.47,43.18 E30.10 109.09,40.64 E25.6 124.33,43.18 E25.10 C26.2 | v102.74,48.26 E30.12 | v125.6,49.53 126.87,48.26 E25.12 | v135.76,53.34 E20.1 | v121.79,16.51 120.52,16.51 | 54.48,20.32 57.02,22.86 95.12,22.86 100.2,27.94 | v79.88,95.25 93.85,95.25 97.66,91.44 C32.2 | v95.12,152.4 E33.1 | E32.1 v101.47,119.38 | C50.2 13.84,55.88 27.81,55.88 | E45.1 27.81,55.88 | 29.08,55.88 C45.2 | 27.81,55.88 29.08,55.88 | E40.1 48.13,55.88 40.51,55.88 | 29.08,55.88 40.51,55.88 | E46.6 32.89,76.2 E46.10 | C51.2 13.84,93.98 24,93.98 26.54,91.44 C46.2 34.16,93.98 49.4,93.98 C41.2 | C54.2 13.84,187.96 17.65,187.96 20.19,190.5 C49.2 34.16,193.04 49.4,193.04 C44.2 | E54.7 12.57,167.64 27.81,167.64 | E48.7 27.81,167.64 | E47.3 E47.4 E47.13 40.51,144.78 E43.7 | E49.3 E49.4 E49.13 | C52.2 13.84,127 29.08,127 | C47.2 29.08,127 | v12.57,134.62 E53.8 | 49.4,127 C42.2 | 29.08,127 49.4,127 | 49.4,127 60.83,127 v63.37,129.54 79.88,129.54 | v68.45,144.78 E39.11 | v68.45,139.7 65.91,137.16 E39.7 | v68.45,152.4 E39.1 | 79.88,129.54 v95.12,129.54 v121.79,129.54 v142.11,129.54 | 79.88,129.54 C37.2 | 48.13,167.64 E44.7 | 27.81,167.64 48.13,167.64 | 40.51,55.88 v40.51,53.34 | E29.7 119.25,167.64 48.13,167.64
  Bottom 0.762: 225.93,30.48 E6.8 | 225.93,30.48 231.01,25.4 C55.- v241.17,17.78 | 225.93,30.48 223.39,30.48 223.39,15.24 213.23,15.24 | 213.23,15.24 213.23,8.89 EDGE.AT2 | 213.23,15.24 v211.96,15.24 | v244.98,16.51 244.98,8.89 EDGE.AF2 | EDGE.AC2 255.14,8.89 255.14,15.24 v252.6,17.78 C1.2 252.6,34.29 E1.8 253.87,38.1 253.87,71.12 | E11.5 v192.91,48.26 E11.1 197.99,57.15 C12.2 199.26,69.85 E12.7 200.53,73.66 200.53,106.68 | E11.12 203.07,45.72 203.07,43.18 E11.9 | E8.1 227.2,120.65 C9.2 227.2,135.89 E9.7 | E6.1 227.2,54.61 C7.2 227.2,69.85 E7.7 | E4.7 252.6,135.89 C4.2 253.87,123.19 253.87,109.22 | E14.7 197.99,125.73 C14.2 200.53,123.19 200.53,106.68 | C13.2 197.99,92.71 E13.7 200.53,106.68 | C2.2 252.6,67.31 E2.8 253.87,71.12 | v227.2,101.6 C8.2 | C3.2 251.33,92.71 E3.8 253.87,104.14 253.87,109.22 | 253.87,109.22 E3.4 | 253.87,71.12 256.41,73.66 256.41,76.2 E2.13 | EDGE.BF2 175.13,8.89 175.13,15.24 v180.21,15.24 185.29,15.24 185.29,8.89 EDGE.BC1 | E27.7 123.06,102.87 v123.06,100.33 C27.2 | v154.81,54.61 C22.2 | E18.7 163.7,102.87 v163.7,92.71 | v142.11,92.71 E22.8 | v171.32,19.05 167.51,22.86 C56.- 166.24,26.67 166.24,36.83 E16.7 168.78,41.91 168.78,55.88 C18.2 166.24,69.85 E17.7 167.51,73.66 167.51,90.17 C19.2 168.78,93.98 v168.78,137.16 168.78,154.94 C21.2 | C16.2 199.26,186.69 E15.1 200.53,182.88 200.53,154.94 | E15.8 197.99,158.75 C15.2 199.26,156.21 200.53,154.94 | 200.53,154.94 203.07,152.4 | 203.07,152.4 E14.13 | E10.8 227.2,166.37 C10.2 | E5.7 252.6,168.91 C5.2 | E10.3 E10.4 | C29.2 121.79,158.75 E29.7 | E19.7 166.24,135.89 C20.2 | C30.2 142.11,190.5 C25.2 145.92,187.96 145.92,173.99 E24.7 142.11,158.75 C24.2
  Bottom 0.762: v201.8,137.16 203.07,138.43 203.07,152.4 | E50.8 10.03,8.89 EDGE.DT2 | v51.94,16.51 51.94,8.89 EDGE.DC1 | EDGE.DF2 41.78,8.89 v41.78,16.51 41.78,39.37 E45.10 40.51,45.72 v40.51,53.34 | E35.7 79.88,36.83 v79.88,16.51 79.88,15.24 | 79.88,15.24 79.88,8.89 EDGE.CT2 | v111.63,16.51 111.63,8.89 EDGE.CF2 | EDGE.BT2 143.38,8.89 143.38,15.24 v142.11,15.24 v142.11,26.67 | v95.12,53.34 C58.2 | E31.7 100.2,69.85 C31.2 100.2,54.61 E30.1 | E21.7 E20.1 | E26.7 E25.1 v125.6,49.53 | v102.74,48.26 101.47,46.99 101.47,43.18 E30.6 | E25.6 124.33,43.18 | 124.33,43.18 E25.12 | C26.2 v135.76,53.34 | C57.- 102.74,26.67 v102.74,48.26 | v102.74,48.26 v102.74,53.34 | 124.33,43.18 124.33,38.1 121.79,35.56 v121.79,16.51 121.79,8.89 EDGE.CC1 | 79.88,15.24 93.85,15.24 C35.2 | E36.1 79.88,87.63 C36.2 v79.88,95.25 | C32.2 101.47,92.71 v101.47,119.38 101.47,123.19 C33.2 | E32.1 95.12,123.19 v95.12,129.54 v95.12,152.4 95.12,179.07 | 95.12,179.07 95.12,181.61 E34.1 98.93,189.23 C34.2 | C38.2 81.15,158.75 81.15,179.07 95.12,179.07 | E40.1 51.94,54.61 C40.2 | E51.1 11.3,87.63 C51.2 11.3,102.87 E52.7 | E49.8 31.62,100.33 C46.2 31.62,87.63 E46.1 32.89,83.82 32.89,81.28 34.16,80.01 | 34.16,80.01 E46.10 | C45.2 34.16,60.96 34.16,80.01 | C43.2 50.67,158.75 E44.7 53.21,172.72 53.21,189.23 C44.2 | C53.2 10.03,158.75 E54.7 | E48.7 30.35,158.75 C48.2 32.89,156.21 32.89,142.24 | E37.1 79.88,120.65 C37.2 79.88,135.89 E38.7 | E41.1 51.94,87.63 C41.2 51.94,102.87 E42.7 53.21,106.68 53.21,123.19 C42.2 | C23.2 142.11,125.73 v142.11,129.54 E23.7 | E28.7 123.06,135.89 123.06,129.54 | C28.2 123.06,129.54 | E39.1 64.64,153.67 C39.2 | v12.57,134.62 12.57,125.73 C52.2
  Bottom 0.762: E47.8 31.62,133.35 C47.2 32.89,123.19 | v63.37,129.54 E39.7 | v68.45,139.7 v68.45,144.78 v68.45,152.4 | E49.3 32.89,116.84 32.89,123.19 | v121.79,129.54 123.06,129.54 | 32.89,142.24 E47.4 | 32.89,123.19 32.89,142.24
  pour Bottom (isolate 0.254): 265.3,15.24 265.3,214.63 -0.13,214.63 -0.13,15.24
  pour Top (isolate 0.254): 265.3,15.24 265.3,214.63 -0.13,214.63 -0.13,15.24
IB0
  Top 0.406: E10.7 227.2,171.45 257.68,171.45 E5.9
IB1
  Top 0.406: E10.9 232.28,168.91 224.66,168.91 224.66,173.99 248.79,173.99 250.06,175.26 E5.5
IB2
  Top 0.406: E10.11 248.79,172.72 250.06,173.99 252.6,173.99 252.6,176.53 250.06,176.53 250.06,182.88 E5.2
IF0
  Top 0.406: E6.6 232.28,46.99 252.6,46.99 252.6,53.34 E1.1
  Bottom 0.406: E2.7 250.06,69.85 250.06,54.61 E1.1
IF1  (via drill 0.81)
  Top 0.406: E6.10 236.09,40.64 E1.6 v255.14,44.45
  Bottom 0.406: E2.9 255.14,64.77 v255.14,44.45
IF2
  Top 0.406: E6.15 237.36,54.61 256.41,54.61 | 256.41,54.61 260.22,58.42 260.22,73.66 E2.11 | E1.10 260.22,39.37 260.22,54.61 256.41,54.61
IND1L  (via drill 0.81)
  Top 0.406: E30.14 107.82,54.61 v140.84,54.61
  Bottom 0.406: v140.84,54.61 140.84,80.01 E21.3
IND2L  (via drill 0.81)
  Top 0.406: v115.44,50.8 E30.13 | v115.44,76.2 116.71,77.47 139.57,77.47 140.84,76.2 E21.5
  Bottom 0.406: v115.44,76.2 v115.44,50.8
INDH  (via drill 0.81)
  Top 0.406: E7.6 208.15,73.66 206.88,72.39 v196.72,72.39 | v192.91,146.05 167.51,146.05 166.24,147.32 E19.3
  Bottom 0.406: v196.72,72.39 192.91,76.2 v192.91,146.05
INITIALIZE  (via drill 0.81)
  Top 0.406: E40.12 76.07,48.26 77.34,49.53 v82.42,49.53 | v82.42,17.78 84.96,17.78 86.23,16.51 86.23,8.89 EDGE.CR1
  Bottom 0.406: v82.42,17.78 v82.42,49.53
INT_IN_PROG_MAMS_LD_CTL  (via drill 0.81)
  Top 0.406: E47.10 39.24,135.89 49.4,135.89 54.48,140.97 57.02,140.97 62.1,146.05 64.64,146.05 64.64,148.59 62.1,148.59 62.1,151.13 69.72,151.13 E39.14 | v177.67,100.33 260.22,100.33 260.22,104.14 E3.10 | v176.4,132.08 v67.18,132.08
  Bottom 0.406: E16.11 176.4,49.53 176.4,80.01 177.67,81.28 v177.67,100.33 177.67,130.81 v176.4,132.08 | E39.14 69.72,153.67 67.18,153.67 v67.18,132.08
INT_IN_PROGRESS
  Bottom 0.406: E39.10 69.72,143.51 69.72,148.59 E39.13
INT_INH  (via drill 0.81)
  Top 0.406: E50.1 3.68,59.69 3.68,129.54 v50.67,129.54 | E26.9 128.14,74.93 90.04,74.93 87.5,77.47 v62.1,77.47
  Bottom 0.406: E26.9 E26.8 | 53.21,132.08 55.75,134.62 E43.8 | 53.21,132.08 v50.67,129.54 | E43.5 46.86,143.51 46.86,146.05 53.21,146.05 53.21,132.08 | v62.1,77.47 62.1,123.19 53.21,132.08
IR01
  Bottom 0.406: E46.12 36.7,82.55 36.7,85.09 E46.14
JMP+JMS
  Top 0.406: E42.11 53.21,116.84 E42.2 E42.1
  Bottom 0.406: 41.78,83.82 44.32,83.82 44.32,77.47 46.86,77.47 46.86,113.03 E42.2 | 41.78,83.82 E46.13 | E48.11 36.7,176.53 36.7,171.45 41.78,171.45 41.78,83.82
LA
  Top 0.406: E25.14 133.22,53.34 134.49,52.07 153.54,52.07 154.81,50.8 E16.2 | E39.5 64.64,140.97 138.3,140.97 140.84,143.51 163.7,143.51 | E19.4 163.7,143.51 | 163.7,143.51 E19.5
  Bottom 0.406: E16.3 E16.2 166.24,52.07 166.24,55.88 163.7,58.42 163.7,90.17 164.97,91.44 164.97,101.6 167.51,104.14 167.51,139.7 E19.5
LOAD_ADDR  (via drill 0.81)
  Top 0.406: E25.9 128.14,39.37 v63.37,39.37 | v16.38,21.59 25.27,30.48 v57.02,30.48
  Bottom 0.406: E40.11 59.56,44.45 59.56,43.18 v63.37,39.37 63.37,36.83 v57.02,30.48 | v16.38,21.59 16.38,8.89 EDGE.DR2
LOAD_CNTL  (via drill 0.81)
  Top 0.406: v180.21,45.72 E11.4
  Bottom 0.406: v180.21,45.72 173.86,39.37 173.86,16.51 172.59,15.24 172.59,8.89 EDGE.BH2
LOAD_CNTLH  (via drill 0.81)
  Top 0.406: v130.68,59.69 v162.43,59.69
  Bottom 0.406: E16.5 162.43,45.72 v162.43,59.69 | v130.68,59.69 130.68,102.87 E27.8
MD03  (via drill 0.81)
  Top 0.406: E11.14 204.34,52.07 154.81,52.07 148.46,58.42 v129.41,58.42 121.79,58.42 120.52,57.15 84.96,57.15 v82.42,59.69 | E32.4 100.2,110.49 v102.74,110.49 v124.33,110.49
  Bottom 0.406: E34.4 100.2,176.53 100.2,140.97 E33.6 102.74,135.89 v102.74,110.49 | v129.41,58.42 124.33,63.5 v124.33,110.49 124.33,116.84 E27.1 | E36.4 82.42,74.93 v82.42,59.69
MD03L
  Top 0.406: E42.10 62.1,113.03 102.74,113.03 105.28,115.57 115.44,115.57 116.71,116.84 E27.2
MD06  (via drill 0.81)
  Top 0.406: E53.1 10.03,163.83 v105.28,163.83 v140.84,163.83 v191.64,163.83 | v148.46,118.11 147.19,119.38 E22.1
  Bottom 0.406: v105.28,163.83 105.28,176.53 E34.11 | E22.1 140.84,120.65 v140.84,163.83 | E20.14 151,52.07 151,49.53 145.92,49.53 145.92,104.14 148.46,106.68 v148.46,118.11 | E15.6 191.64,166.37 v191.64,163.83
MD07  (via drill 0.81)
  Top 0.406: v144.65,109.22 E22.14 152.27,114.3 v154.81,116.84 | E53.6 16.38,146.05 21.46,146.05 31.62,156.21 v104.01,156.21 | E15.10 206.88,168.91 206.88,165.1 v153.54,165.1 v104.01,165.1
  Bottom 0.406: E20.3 144.65,48.26 v144.65,109.22 | v104.01,156.21 v104.01,165.1 104.01,177.8 E34.12 | v154.81,116.84 154.81,143.51 153.54,144.78 v153.54,165.1
MD08  (via drill 0.81)
  Top 0.406: E45.13 36.7,52.07 15.11,52.07 4.95,62.23 4.95,128.27 v16.38,128.27 51.94,128.27 54.48,130.81 v109.09,130.81 156.08,130.81 v157.35,129.54 | E22.15 152.27,119.38 v156.08,119.38 | E15.15 200.53,182.88 199.26,181.61 v110.36,181.61
  Bottom 0.406: v16.38,128.27 16.38,135.89 E53.10 | v156.08,119.38 157.35,120.65 v157.35,129.54 | 107.82,173.99 109.09,172.72 v109.09,130.81 | 107.82,173.99 E34.10 | v110.36,181.61 107.82,179.07 107.82,173.99
MD09  (via drill 0.81)
  Top 0.406: v41.78,76.2 44.32,78.74 v45.59,78.74 E41.4 | E33.9 102.74,135.89 53.21,135.89 v48.13,130.81
  Bottom 0.406: E45.14 41.78,57.15 v41.78,76.2 | v48.13,130.81 45.59,128.27 v45.59,78.74
MD10  (via drill 0.81)
  Top 0.406: E32.11 107.82,113.03 120.52,113.03 E27.3 | v30.35,67.31 37.97,67.31 44.32,73.66 E41.6 | v54.48,67.31 v117.98,67.31
  Bottom 0.406: E45.2 31.62,52.07 31.62,55.88 30.35,57.15 v30.35,67.31 | E41.5 E41.6 51.94,72.39 51.94,69.85 v54.48,67.31 | E27.3 123.06,113.03 123.06,105.41 120.52,105.41 120.52,90.17 123.06,87.63 123.06,72.39 117.98,72.39 v117.98,67.31
MYC1
  Top 0.406: E21.8 144.65,71.12 143.38,72.39 123.06,72.39 E26.6
  Bottom 0.406: E26.5 E26.6
N$1  (via drill 0.81)
  Top 0.406: E35.12 87.5,49.53 v91.31,49.53 | v91.31,125.73 93.85,128.27 v156.08,128.27 | v156.08,175.26 152.27,179.07 143.38,179.07 E24.3
  Bottom 0.406: v91.31,125.73 v91.31,49.53 | v156.08,175.26 v156.08,128.27
N$3
  Bottom 0.406: E27.10 130.68,110.49 130.68,166.37 128.14,168.91 128.14,176.53 | E29.11 128.14,176.53 | E29.13 128.14,181.61 128.14,176.53
N$4  (via drill 0.81)
  Top 0.406: E31.1 100.2,87.63 v134.49,87.63 | v138.3,116.84 E22.2
  Bottom 0.406: R4.1 135.76,86.36 v134.49,87.63 138.3,91.44 v138.3,116.84
N$5
  Bottom 0.406: E31.6 E31.5 100.2,77.47 100.2,80.01 E31.3 E31.2 96.39,86.36 96.39,111.76 E32.3
N$6
  Bottom 0.406: E36.3 82.42,85.09 82.42,105.41 E37.5
N$8
  Bottom 0.406: E36.2 81.15,86.36 81.15,104.14 E37.6
N$9
  Bottom 0.406: E36.14 87.5,87.63 87.5,105.41 E37.9
N$11
  Bottom 0.406: E14.6 196.72,140.97 196.72,148.59 E14.2
N$13  (via drill 0.81)
  Top 0.406: v59.56,179.07 51.94,179.07 E44.3
  Bottom 0.406: E38.4 77.34,146.05 77.34,148.59 70.99,154.94 70.99,167.64 v59.56,179.07
N$14
  Bottom 0.406: E40.5 49.4,44.45 49.4,49.53 E40.2
N$19  (via drill 0.81)
  Top 0.406: E41.2 51.94,82.55 v125.6,82.55
  Bottom 0.406: v125.6,82.55 125.6,107.95 E27.11
N$21  (via drill 0.81)
  Top 0.406: E38.13 E38.12 | v82.42,177.8 E44.11
  Bottom 0.406: v82.42,177.8 83.69,176.53 83.69,152.4 E38.13
N$22  (via drill 0.81)
  Top 0.406: E33.12 E33.11 E33.4 v92.58,144.78 | v92.58,106.68 E32.6 | E45.4 E45.11 48.13,45.72 49.4,46.99 v96.39,46.99 123.06,46.99 | 123.06,46.99 E25.3 | 123.06,46.99 137.03,46.99 138.3,45.72 E20.4 E20.11
  Bottom 0.406: v92.58,144.78 v92.58,106.68 92.58,66.04 96.39,62.23 v96.39,46.99 | E34.6 97.66,171.45 97.66,146.05 E33.4 | E20.11 E20.10 | E20.6 140.84,41.91 140.84,44.45 E20.4
N$23
  Top 0.406: E38.9 E38.6
  Bottom 0.406: E38.9 E38.10
N$24  (via drill 0.81)
  Top 0.406: v145.92,168.91 147.19,170.18 E24.8
  Bottom 0.406: E23.13 145.92,153.67 v145.92,168.91
N$25
  Top 0.406: E43.6 50.67,142.24 E43.10
  Bottom 0.406: E43.13 54.48,148.59 54.48,143.51 E43.10
N$26  (via drill 0.81)
  Top 0.406: E36.5 E36.10 92.58,69.85 105.28,69.85 106.55,68.58 121.79,68.58 v123.06,67.31
  Bottom 0.406: E36.5 E36.6 | E25.13 123.06,57.15 v123.06,67.31
N$27  (via drill 0.81)
  Top 0.406: v101.47,185.42 102.74,186.69 120.52,186.69 E29.1 | v125.6,175.26 E29.10
  Bottom 0.406: E31.8 E31.9 111.63,78.74 111.63,186.69 106.55,191.77 101.47,191.77 v101.47,185.42 101.47,182.88 E34.3 | v125.6,175.26 124.33,176.53 124.33,182.88 E29.1
N$28
  Top 0.406: E14.8 206.88,138.43 206.88,151.13 199.26,151.13 E14.1
N$29  (via drill 0.81)
  Top 0.406: v54.48,73.66 55.75,72.39 77.34,72.39 E36.7
  Bottom 0.406: E41.3 54.48,77.47 v54.48,73.66
N$32  (via drill 0.81)
  Top 0.406: E23.12 152.27,144.78 v159.89,144.78 | v161.16,82.55 162.43,81.28 E17.3
  Bottom 0.406: v159.89,144.78 161.16,143.51 v161.16,82.55
N$33  (via drill 0.81)
  Top 0.406: E34.9 107.82,171.45 123.06,171.45 123.06,166.37 v137.03,166.37
  Bottom 0.406: v137.03,166.37 138.3,165.1 138.3,119.38 139.57,118.11 139.57,53.34 E20.2
N$34  (via drill 0.81)
  Top 0.406: v147.19,68.58 145.92,69.85 110.36,69.85 107.82,72.39 v101.47,72.39
  Bottom 0.406: E34.5 96.39,172.72 96.39,144.78 E33.5 97.66,140.97 97.66,123.19 100.2,120.65 100.2,110.49 E32.5 97.66,107.95 97.66,91.44 101.47,87.63 v101.47,72.39 | E20.13 147.19,53.34 v147.19,68.58
N$36  (via drill 0.81)
  Top 0.406: E14.10 199.26,148.59 v181.48,148.59
  Bottom 0.406: v181.48,148.59 175.13,154.94 175.13,167.64 147.19,195.58 39.24,195.58 39.24,176.53 E48.10
N$37  (via drill 0.81)
  Top 0.406: v154.81,114.3 E18.3 | E23.9 v153.54,139.7
  Bottom 0.406: v154.81,114.3 153.54,115.57 v153.54,139.7
N$40  (via drill 0.81)
  Top 0.406: E42.8 59.56,105.41 137.03,105.41 139.57,107.95 v143.38,107.95 | v143.38,87.63 201.8,87.63 E12.13
  Bottom 0.406: E12.10 E12.11 204.34,80.01 204.34,82.55 E12.13 | v143.38,87.63 v143.38,107.95
N$42  (via drill 0.81)
  Top 0.406: R2.1 158.62,74.93 171.32,74.93 E17.10 v180.21,76.2 | E13.4 196.72,113.03 v181.48,113.03
  Bottom 0.406: v181.48,113.03 180.21,111.76 v180.21,76.2
N$43  (via drill 0.81)
  Top 0.406: v101.47,59.69 128.14,59.69 129.41,60.96 182.75,60.96 v190.37,68.58 | v190.37,140.97 194.18,144.78 E14.4
  Bottom 0.406: E30.3 101.47,50.8 v101.47,59.69 | v190.37,140.97 v190.37,68.58
N$44  (via drill 0.81)
  Top 0.406: v201.8,83.82 199.26,86.36 E12.1 | E42.12 59.56,115.57 100.2,115.57 105.28,120.65 191.64,120.65 v196.72,115.57
  Bottom 0.406: E12.9 206.88,72.39 206.88,69.85 201.8,69.85 v201.8,83.82 | v196.72,115.57 196.72,87.63 E12.1
N$47  (via drill 0.81)
  Top 0.406: E18.6 163.7,107.95 v147.19,107.95
  Bottom 0.406: v147.19,107.95 147.19,146.05 143.38,149.86 143.38,151.13 E23.1
N$49  (via drill 0.81)
  Top 0.406: v194.18,81.28 E17.12
  Bottom 0.406: v194.18,81.28 194.18,135.89 196.72,138.43 199.26,138.43 199.26,146.05 E14.3
N$50  (via drill 0.81)
  Top 0.406: E41.14 59.56,87.63 v65.91,87.63 | v65.91,142.24 67.18,143.51 114.17,143.51 115.44,144.78 116.71,144.78 | E28.4 116.71,144.78 | 116.71,144.78 E28.2
  Bottom 0.406: v65.91,142.24 v65.91,87.63
N$52  (via drill 0.81)
  Top 0.406: v123.06,138.43 154.81,138.43 156.08,139.7 E19.6
  Bottom 0.406: E29.3 123.06,179.07 123.06,176.53 120.52,176.53 120.52,156.21 123.06,153.67 v123.06,138.43
N$53  (via drill 0.81)
  Top 0.406: E19.8 171.32,138.43 v157.35,138.43
  Bottom 0.406: E43.2 46.86,151.13 46.86,187.96 53.21,194.31 119.25,194.31 119.25,193.04 | 119.25,193.04 119.25,180.34 E29.4 | v157.35,138.43 157.35,184.15 148.46,193.04 119.25,193.04
N$54  (via drill 0.81)
  Top 0.406: E31.12 E31.11 | E33.3 102.74,151.13 v110.36,151.13 128.14,151.13 E28.13
  Bottom 0.406: E28.10 128.14,143.51 128.14,148.59 E28.13 | E31.12 110.36,85.09 v110.36,151.13
N$55
  Top 0.406: E28.12 E28.3
N$56
  Top 0.406: E28.9 E28.6
N$57  (via drill 0.81)
  Top 0.406: E27.5 125.6,109.22 128.14,111.76 128.14,115.57 | 128.14,115.57 128.14,116.84 E27.13 | v124.33,167.64 E29.9 | v40.51,67.31 41.78,68.58 v104.01,68.58 | 128.14,115.57 116.71,115.57 115.44,114.3 E32.12
  Bottom 0.406: v124.33,167.64 124.33,120.65 128.14,116.84 E27.13 | E45.3 36.7,48.26 36.7,55.88 40.51,59.69 v40.51,67.31 | v104.01,68.58 104.01,111.76 E32.12
N$58
  Bottom 0.406: E27.6 119.25,109.22 119.25,149.86 E28.1
N$59
  Bottom 0.406: E27.4 120.52,113.03 120.52,140.97 E28.5
N$62
  Top 0.406: E24.9 E24.6
N$63
  Top 0.406: E23.4 145.92,148.59 171.32,148.59 E19.13
N$64
  Top 0.406: E23.6 147.19,139.7 148.46,140.97 171.32,140.97 E19.9
N$65  (via drill 0.81)
  Top 0.406: v159.89,142.24 E23.10 | E17.1 v159.89,86.36
  Bottom 0.406: v159.89,86.36 v159.89,142.24
N$66  (via drill 0.81)
  Top 0.406: v144.65,170.18 143.38,171.45 133.22,171.45 130.68,173.99 123.06,173.99 E29.6
  Bottom 0.406: E23.11 144.65,149.86 v144.65,170.18
N$67  (via drill 0.81)
  Top 0.406: v137.03,119.38 131.95,114.3 E27.12
  Bottom 0.406: E29.2 120.52,184.15 120.52,186.69 123.06,189.23 135.76,189.23 135.76,120.65 v137.03,119.38
N$68
  Top 0.406: E46.3 31.62,80.01 84.96,80.01 E36.11
N$69  (via drill 0.81)
  Top 0.406: v168.78,162.56 v59.56,162.56 | v162.43,78.74 E17.4
  Bottom 0.406: E43.9 59.56,143.51 v59.56,162.56 | E19.11 173.86,146.05 173.86,157.48 v168.78,162.56 162.43,156.21 v162.43,78.74
N$71  (via drill 0.81)
  Top 0.406: v168.78,184.15 36.7,184.15 36.7,181.61 46.86,181.61 E44.4
  Bottom 0.406: E12.8 203.07,73.66 203.07,101.6 201.8,102.87 201.8,134.62 200.53,135.89 200.53,152.4 v168.78,184.15
N$72
  Bottom 0.406: E43.1 48.13,170.18 E44.6
N$73
  Bottom 0.406: E43.12 58.29,149.86 E44.8
N$74  (via drill 0.81)
  Top 0.406: v228.47,185.42 227.2,184.15 209.42,184.15 206.88,181.61 200.53,181.61 199.26,180.34 E15.3
  Bottom 0.406: E9.4 228.47,147.32 v228.47,185.42
N$75
  Top 0.406: E15.4 199.26,176.53 211.96,176.53 225.93,162.56 E9.1
N$76
  Top 0.406: E15.12 208.15,172.72 214.5,172.72 224.66,162.56 224.66,148.59 232.28,148.59 E9.13
N$77  (via drill 0.81)
  Top 0.406: E9.10 229.74,146.05 v209.42,146.05
  Bottom 0.406: v209.42,146.05 208.15,147.32 208.15,175.26 E15.13
N$78
  Bottom 0.406: E8.2 228.47,119.38 228.47,139.7 E9.5
N$79
  Top 0.406: E5.13 260.22,181.61 260.22,151.13 227.2,151.13 E9.2
  Bottom 0.406: E8.3 224.66,115.57 224.66,148.59 E9.2
N$80
  Top 0.406: E4.2 248.79,147.32 E9.12
  Bottom 0.406: E8.13 231.01,119.38 231.01,144.78 E9.12
N$81
  Top 0.406: E4.5 248.79,139.7 E9.9
  Bottom 0.406: E8.14 233.55,134.62 232.28,135.89 232.28,138.43 E9.9
N$82